# Altium schematic sheet Polarity_Select_12Vinput.SchDoc: RP2040 CNC
size B; Author: AM; CompanyName: Expatria Technologies; DrawnBy: A.Marles; Engineer: AM; Organization: Expatria Technolgoies; DocumentNumber: 13; SheetNumber: 13; SheetTotal: 14
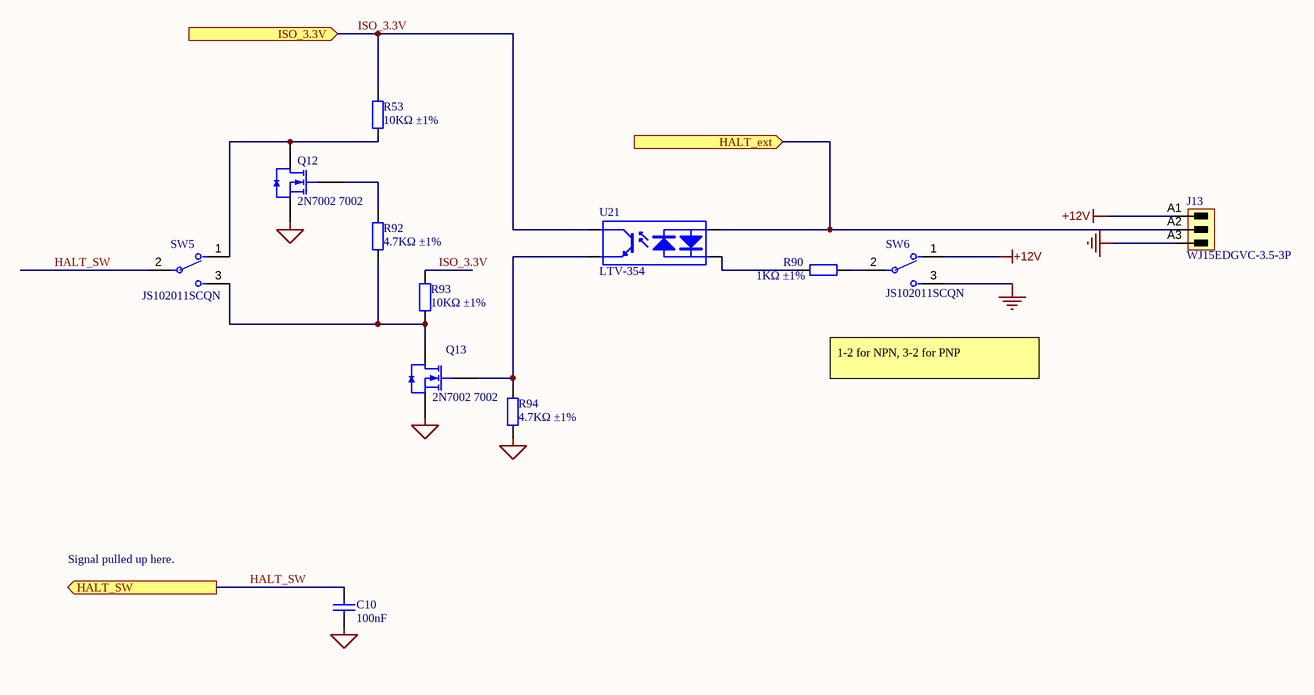
[diagram p0: Polarity_Select_12Vinput.SchDoc]

## Parts
C10  100nF  [0402_C]
J13  WJ15EDGVC-3.5-3P  [691321100003 - 3.5mm  3p]
Q12  2N7002 7002  [SOT-23(SOT-23-3)]
Q13  2N7002 7002  [SOT-23(SOT-23-3)]
R53  10KΩ ±1%  [0402_R]
R90  1KΩ ±1%  [0402_R]
R92  4.7KΩ ±1%  [0402_R]
R93  10KΩ ±1%  [0402_R]
R94  4.7KΩ ±1%  [0402_R]
SW5  JS102011SCQN  [FP-JS102011SCQN-MFG]
SW6  JS102011SCQN  [FP-JS102011SCQN-MFG]
U21  LTV-354  [SOP-4_P2.54]

## Ports
HALT_ext (in), HALT_SW (out), ISO_3.3V (in)

## Nets
+12V: J13.A1 SW6.1
GND: J13.A3 SW6.3
MCU_GND: C10.1 Q12.2(S) Q13.2(S) R94.1
HALT_ext: J13.A2 U21.1(A) ; port HALT_ext
HALT_SW: C10.2 SW5.2(C) ; port HALT_SW
ISO_3.3V: R53.2 R93.2 U21.4(C) ; port ISO_3.3V
NetQ12_1: Q12.1(G) R92.2
NetQ12_3: Q12.3(D) R53.1 SW5.1
NetQ13_1: Q13.1(G) R94.2 U21.3(E)
NetQ13_3: Q13.3(D) R92.1 R93.1 SW5.3
NetR90_1: R90.1 U21.2(K)
NetR90_2: R90.2 SW6.2(C)

## Notes on the sheet
- 1-2 for NPN, 3-2 for PNP
- Signal pulled up here.
- SHEET
- Expatria Technologies
- 1136 Glade Court
- Port Coquitlam, BC V3B 1R5
- PROJECT
- SIZE
- ENGR
- MODIFIED
- DOCUMENT
- REV
- Copyright Expatria Technologies 2022. This document describes Open Hardware and is licensed under the CERN-OHL-S v2. No warranty is implied or expressed.
- EMAIL: INFO@EXPATRIA.CA
- B
- /

## Library data of the parts
C10 = 0402 100nF (104) 10% 16V: Chip capacitors; Manufacturer: Samsung Electro-Mechanics; PartNumber: CL05B104KO5NNNC; Tolerance: 10%; Voltage: 16V; ComponentLink1Description: Supplier link; ComponentLink1URL: http://www.szlcsc.com/product/details_1877.html; Package: 0402; Supplier: LC; SuppliersPartNumber: C1525; Capacitance: 100nF
J13 = 3.5mm Terminal Header 3p: Header,Male Pin,Covered(4 Sided) 3 1 0.138"（3.50mm） 3 P=3.5mm Pluggable System Terminal Block RoHS; Manufacturer: Weidmueller; Manufacturer 1: Weidmuller; Manufacturer Part Number 1: 1604480000; Pitch_mm: 3.5 mm; UL_94_flammability_rating: V-0; Side_termination_characteristic: closed side; Solder_pin_length_mm: 3.2 mm; Short_text_for_material: SL 3.50/03/180G 3.2SN OR BX; Pitch_inch: 0.138 inch; PartNumber: WJ15EDGVC-3.5-3P; PackageReference: SL_3_50_180G_03; ComponentLink1URL: http://www.weidmueller.com/; ComponentLink1Description: Manufacturer URL; Packaging: Box; Revision: V1; SuppliersPartNumber: C192778
Q12 Q13 = 2N7002 7002: MOS(场效应管); ComponentLink1Description: 供应商链接; ComponentLink1URL: http://www.szlcsc.com/product/details_9040.html; Package: SOT-23(SOT-23-3); Supplier: LC; SuppliersPartNumber: C8545
R53 R93 = 0402 10K (1002) 1%: Chip resistor; Manufacturer: Uniroyal Elec; PartNumber: 0402WGF1002TCE; Power: 1/16W; ComponentLink1Description: Supplier link; ComponentLink1URL: http://www.szlcsc.com/product/details_26487.html; Package: 0402; Supplier: LC; SuppliersPartNumber: C25744; Resistance: 10KΩ; Tolerance: 1%
R90 = 0402 1K (1001) 1%: Chip resistor; Manufacturer: Uniroyal Elec; PartNumber: 0402WGF1001TCE; Power: 1/16W; ComponentLink1Description: Supplier link; ComponentLink1URL: http://www.szlcsc.com/product/details_12256.html; Package: 0402; Supplier: LC; SuppliersPartNumber: C11702; Resistance: 1KΩ; Tolerance: 1%
R92 R94 = 0402 4.7K (4701) 1%: Chip resistor; Manufacturer: Uniroyal Elec; PartNumber: 0402WGF4701TCE; Power: 1/16W; ComponentLink1Description: Supplier link; ComponentLink1URL: http://www.szlcsc.com/product/details_26643.html; Package: 0402; Supplier: LC; SuppliersPartNumber: C25900; Resistance: 4.7KΩ; Tolerance: 1%
SW5 SW6 = CMP-00007-1: Switch Slide SPDT Top Slide 0.3A 30VDC Gull Wing SMD T/R; Manufacturer 1: C&K; SuppliersPartNumber: C221661; Manufacturer Part Number 1: JS102011SCQN
U21 = LTV-354: 35V 3.75kV 50mA 100mV@1mA,20mA 1 1.2V AC,DC SOP-4-2.54mm Transistor, Photovoltaic Output Optoisolators ROHS; Package: SOP-4_P2.54; Supplier: LC; SuppliersPartNumber: C10802